# Altium schematic sheet Controller.SchDoc: Controller
size A4; Organization: ЗАО "ПИК Прогресс"; Revision: 1.0; SheetNumber: 1; PageSetup: Record=PageOptions|CenterHorizontal=True|CenterVertical=True|PrintScale=0.94|XCorrection=1.00|YCorrection=1.00|PrintKind=1|BorderSize=5000000|LeftOffset=0|BottomOffset=0|Orientation=1|PaperLength=1000|PaperWidth=1000|Scale=100|PaperSource=7|PrintQuality=-4|MediaType=1|DitherType=10|PaperKind=A4|PrintScaleMode=1; DecimalNumber: Децимальный номер; HeadOfSector: Нач. сектора; MainDevice: Перв.примен.; Name: Наименование; Scale: 1:1; DocumentType: Схема электрическая принципиальная; FirstReferrence: АБВГ.123456.001; ProjectName: Магнитный датчик
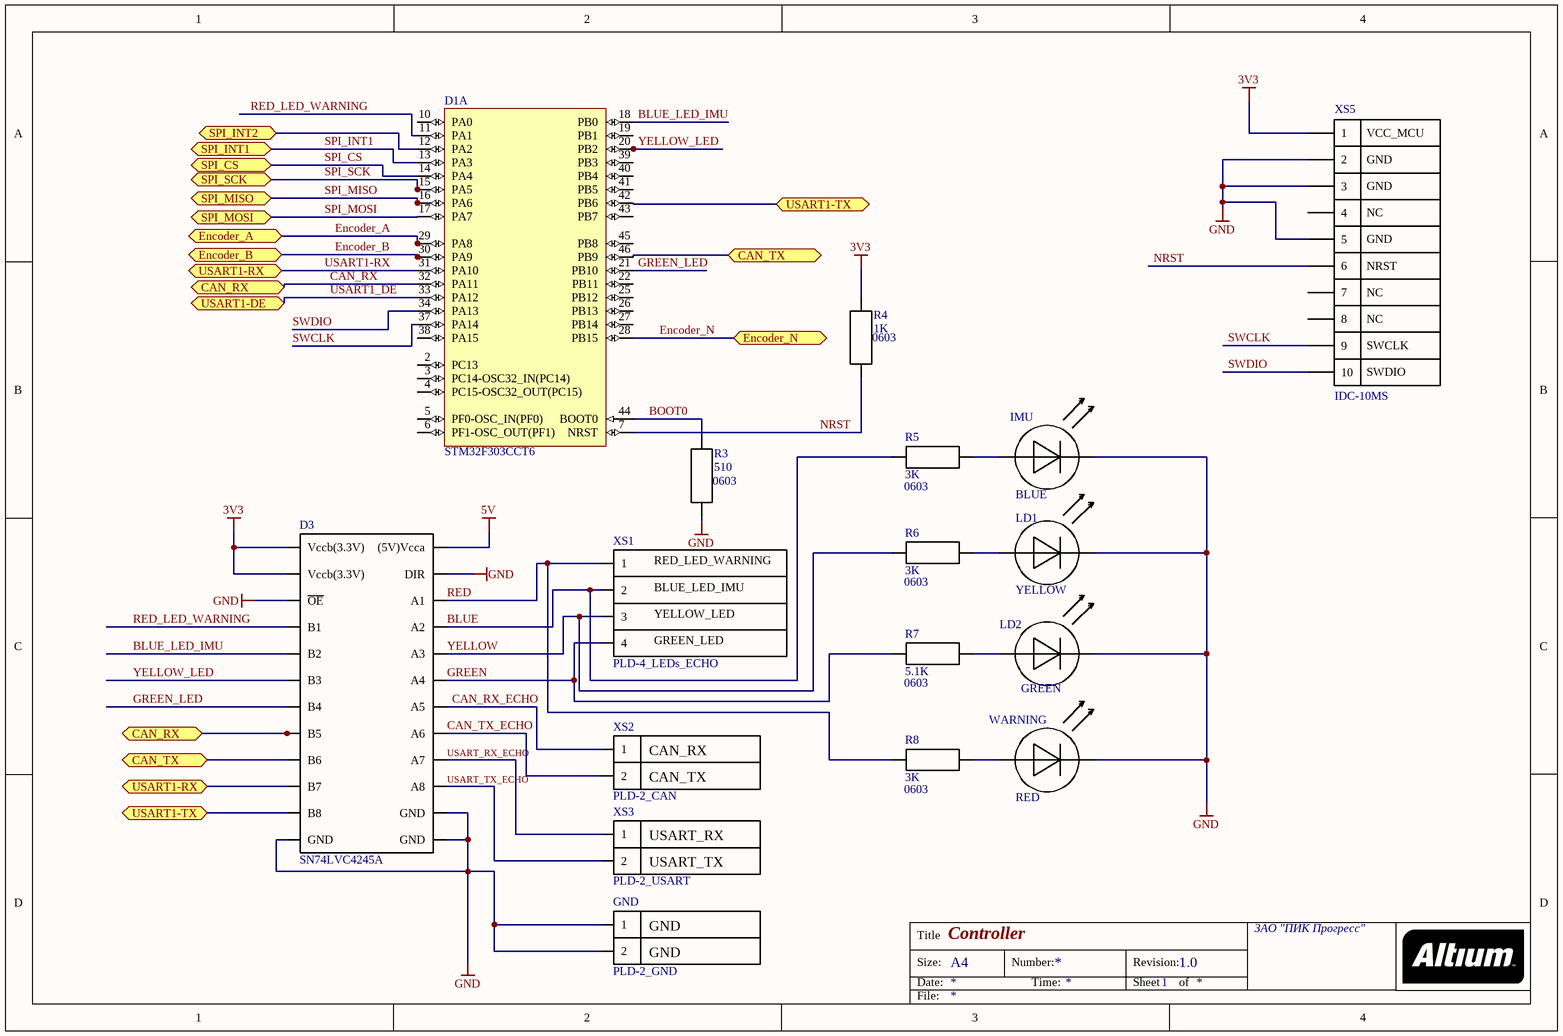
[diagram p0: Controller.SchDoc]

## Parts
D1  STM32F303CCT6  [STM-LQFP48_N]  (part A of 2)
D3  SN74LVC4245A  [SOIC_24_DW(R-PDSO-G24)]
GND  PLD-2_GND  [PLS_2_simple]
IMU  BLUE  [SMD_LED_3216]
LD1  YELLOW  [SMD_LED]
LD2  GREEN  [SMD_LED]
R3  510  [SMD_0603]
R4  1K  [SMD_0603]
R5  3K  [SMD_0603]
R6  3K  [SMD_0603]
R7  5.1K  [SMD_0603]
R8  3K  [SMD_0603]
WARNING  RED  [SMD_LED]
XS1  PLD-4_LEDs_ECHO  [PLS_4]
XS2  PLD-2_CAN  [PLS_2_simple]
XS3  PLD-2_USART  [PLS_2_simple]
XS5  IDC-10MS  [IDC-10MS]

## Ports
CAN_RX, CAN_TX, Encoder_A, Encoder_B, Encoder_N, SPI_CS, SPI_INT1, SPI_INT2, SPI_MISO, SPI_MOSI, SPI_SCK, USART1-DE, USART1-RX, USART1-TX

## Nets
3V3: D3.23(Vccb(3.3V)) D3.24(Vccb(3.3V)) R4.2 XS5.1
5V: D3.1((5V)Vcca)
GND: D3.2(DIR) D3.11(GND) D3.12(GND) D3.13(GND) D3.22(~{OE}) GND.1 GND.2 IMU.1 LD1.1 LD2.1 R3.1 WARNING.1 XS5.2 XS5.3 XS5.5
BLUE: D3.4(A2) R5.1 XS1.2
BLUE_LED_IMU: D1.18(PB0) D3.20(B2)
BOOT0: D1.44(BOOT0) R3.2
CAN_RX: D1.32(PA11) D3.17(B5) ; port CAN_RX
CAN_RX_ECHO: D3.7(A5) XS2.1
CAN_TX: D1.46(PB9) D3.16(B6) ; port CAN_TX
CAN_TX_ECHO: D3.8(A6) XS2.2
Encoder_A: D1.29(PA8) ; port Encoder_A
Encoder_B: D1.30(PA9) ; port Encoder_B
Encoder_N: D1.28(PB15) ; port Encoder_N
GREEN: D3.6(A4) R7.1 XS1.4
GREEN_LED: D1.21(PB10) D3.18(B4)
NRST: D1.7(NRST) R4.1 XS5.6
RED: D3.3(A1) R8.1 XS1.1
RED_LED_WARNING: D1.11(PA1) D3.21(B1)
SPI_CS: D1.14(PA4) ; port SPI_CS
SPI_INT1: D1.13(PA3) ; port SPI_INT1
SPI_INT2: D1.12(PA2) ; port SPI_INT2
SPI_MISO: D1.16(PA6) ; port SPI_MISO
SPI_MOSI: D1.17(PA7) ; port SPI_MOSI
SPI_SCK: D1.15(PA5) ; port SPI_SCK
SWCLK: D1.37(PA14) XS5.9
SWDIO: D1.34(PA13) XS5.10
USART1-RX: D1.31(PA10) D3.15(B7) ; port USART1-RX
USART1-TX: D1.42(PB6) D3.14(B8) ; port USART1-TX
USART1_DE: D1.33(PA12) ; port USART1-DE
USART_RX_ECHO: D3.9(A7) XS3.1
USART_TX_ECHO: D3.10(A8) XS3.2
YELLOW: D3.5(A3) R6.1 XS1.3
YELLOW_LED: D1.20(PB2) D3.19(B3)
NetIMU_2: IMU.2 R5.2
NetLD1_2: LD1.2 R6.2
NetLD2_2: LD2.2 R7.2
NetR8_2: R8.2 WARNING.2

Not connected (* = marked no-connect by the designer): D1 2(PC13) 3(PC14-OSC32_IN(PC14)) 4(PC15-OSC32_OUT(PC15)) 5(PF0-OSC_IN(PF0)) 6(PF1-OSC_OUT(PF1)) 10(PA0) 19(PB1) 22(PB11) 25(PB12) 26(PB13) 27(PB14) 38(PA15) 39(PB3) 40(PB4) 41(PB5) 43(PB7) 45(PB8); XS5 4 7 8

## Notes on the sheet
- (near R4) 0603
- (near R3) 0603
- (near R5) 0603
- (near R6) 0603
- (near R7) 0603
- (near R8) 0603
- Title
- Size:
- Date:
- A4
- Number:
- Time:
- Revision:
- Sheet
- of
- File:
- (in symbol IDC-10MS) VCC_MCU; GND; NC; NRST; SWCLK; SWDIO
- (in symbol PLD-2_CAN) CAN_RX; CAN_TX
- (in symbol PLD-2_USART) USART_RX; USART_TX
- (in symbol PLD-4_LEDs_ECHO) RED_LED_WARNING; BLUE_LED_IMU; YELLOW_LED; GREEN_LED

## Library data of the parts
D1 = STM32F303CCT6: ARM Cortex-M4 32-bit MCU, 256 KB Flash, 40 KB Internal RAM, 37 I/Os, 48-pin LQFP, -40 to 85 degC, Tray; D/A Converter: 2x12-bit (2 Channel); FLASH Size (Prog) (kB): 256; I/Os (High Current): 37; Internal RAM Size (kB): 40; Operating Frequency(F) (Processor speed) (MHz): 72; Supply Voltage(Vcc) min (V): 2; DatasheetVersion: Rev. 6; PackageVersion: Rev. 6, 06/2013; PackageReference: LQFP48; PackageDescription: 48-Pin Low Profile Quad Flat Package, 7 x 7 mm Body, 0.5 mm Pitch; Supplier 1: Digi-Key; Supplier Part Number 1: 497-13318-ND; Supplier 2: Newark; Supplier Part Number 2: 46W2192; Supplier 3: Newark; Supplier Part Number 3: 66W7286; Supplier 4: Mouser; Supplier Part Number 4: 511-STM32F303CCT6; Core: ARM Cortex-M4; Packing: Tray; Mounting Technology: Surface Mount; PartNumber: STM32F303CCT6; ComponentLink1Description: Manufacturer URL; ComponentLink1URL: http://www.st.com/web/en/home.html; ComponentLink2Description: Datasheet; ComponentLink2URL: http://www.st.com/st-web-ui/static/active/en/resource/technical/document/datasheet/DM00058181.pdf; ComponentLink3Description: Package Specification; ComponentLink3URL: http://www.st.com/st-web-ui/static/active/en/resource/technical/document/datasheet/DM00058181.pdf
D3 = SN74LVC4245A: optic bus transiever with 3-state
IMU LD1 LD2 WARNING = LED_Diode
R3-R8 = Resistor